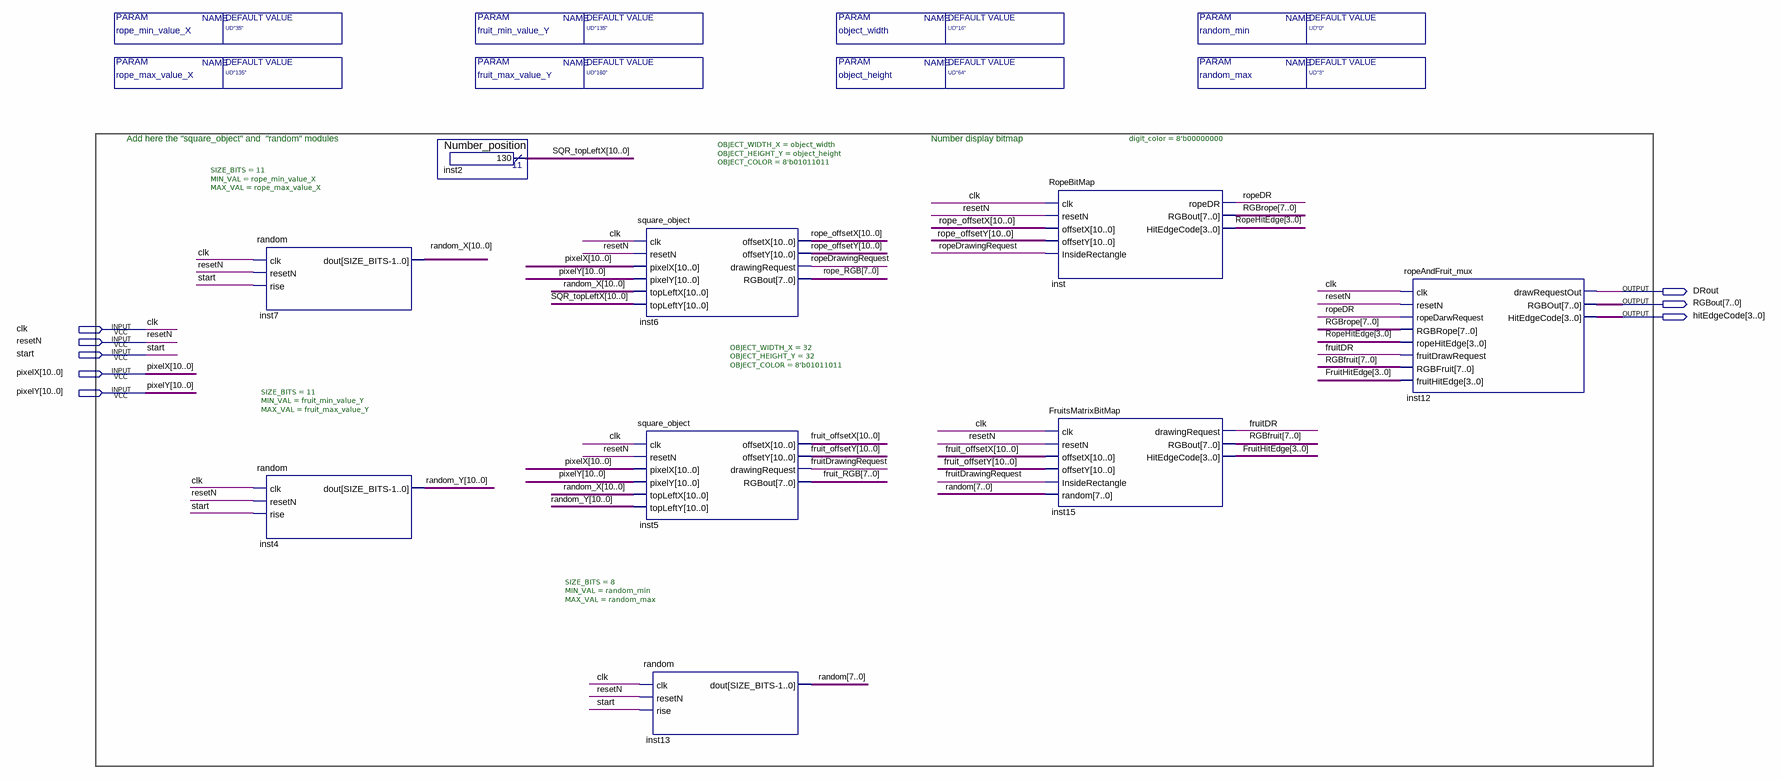
[diagram p0: schematic sheet]
// Quartus schematic ROPE_DISPLAY.bdf as structural Verilog: 9 symbols, 8 pins
module ROPE_DISPLAY #(parameter object_width = "UD\"16\"", parameter object_height = "UD\"64\"", parameter fruit_min_value_Y = "UD\"135\"", parameter fruit_max_value_Y = "UD\"160\"", parameter rope_min_value_X = "UD\"35\"", parameter rope_max_value_X = "UD\"135\"", parameter random_min = "UD\"0\"", parameter random_max = "UD\"3\"") (
  input  clk,
  input  resetN,
  input  start,
  input  [10:0] pixelX,
  input  [10:0] pixelY,
  output DRout,
  output [7:0] RGBout,
  output [3:0] hitEdgeCode
);

  wire fruitDR, fruitDrawingRequest, ropeDR, ropeDrawingRequest;
  wire [3:0] FruitHitEdge, RopeHitEdge;
  wire [7:0] fruit_RGB, random, RGBfruit, RGBrope, rope_RGB;
  wire [10:0] fruit_offsetX, fruit_offsetY, random_X, random_Y, rope_offsetX, rope_offsetY, SQR_topLeftX;

  random #(.SIZE_BITS(11), .MIN_VAL(rope_min_value_X), .MAX_VAL(rope_max_value_X)) inst7 (
    .clk(clk), .resetN(resetN), .rise(start), .dout(random_X));
  random #(.SIZE_BITS(11), .MIN_VAL(fruit_min_value_Y), .MAX_VAL(fruit_max_value_Y)) inst4 (
    .clk(clk), .resetN(resetN), .rise(start), .dout(random_Y));
  Number_position inst2 (.result(SQR_topLeftX));
  square_object #(.OBJECT_WIDTH_X(object_width), .OBJECT_HEIGHT_Y(object_height), .OBJECT_COLOR(8'b01011011)) inst6 (
    .clk(clk), .resetN(resetN), .pixelX(pixelX), .pixelY(pixelY), .topLeftX(random_X),
    .topLeftY(SQR_topLeftX), .offsetX(rope_offsetX), .offsetY(rope_offsetY),
    .drawingRequest(ropeDrawingRequest), .RGBout(rope_RGB));
  square_object #(.OBJECT_WIDTH_X(32), .OBJECT_HEIGHT_Y(32), .OBJECT_COLOR(8'b01011011)) inst5 (
    .clk(clk), .resetN(resetN), .pixelX(pixelX), .pixelY(pixelY), .topLeftX(random_X), .topLeftY(random_Y),
    .offsetX(fruit_offsetX), .offsetY(fruit_offsetY), .drawingRequest(fruitDrawingRequest), .RGBout(fruit_RGB));
  random #(.SIZE_BITS(8), .MIN_VAL(random_min), .MAX_VAL(random_max)) inst13 (
    .clk(clk), .resetN(resetN), .rise(start), .dout(random));
  RopeBitMap #(.digit_color(8'b00000000)) inst (
    .clk(clk), .resetN(resetN), .offsetX(rope_offsetX), .offsetY(rope_offsetY),
    .InsideRectangle(ropeDrawingRequest), .ropeDR(ropeDR), .RGBout(RGBrope), .HitEdgeCode(RopeHitEdge));
  FruitsMatrixBitMap inst15 (
    .clk(clk), .resetN(resetN), .offsetX(fruit_offsetX), .offsetY(fruit_offsetY),
    .InsideRectangle(fruitDrawingRequest), .random(random), .drawingRequest(fruitDR), .RGBout(RGBfruit),
    .HitEdgeCode(FruitHitEdge));
  ropeAndFruit_mux inst12 (
    .clk(clk), .resetN(resetN), .ropeDarwRequest(ropeDR), .RGBRope(RGBrope), .ropeHitEdge(RopeHitEdge),
    .fruitDrawRequest(fruitDR), .RGBFruit(RGBfruit), .fruitHitEdge(FruitHitEdge), .drawRequestOut(DRout),
    .RGBOut(RGBout), .HitEdgeCode(hitEdgeCode));

  // Notes on the sheet:
  //   Add here the "square_object" and  "random" modules
  //   Number display bitmap
endmodule
